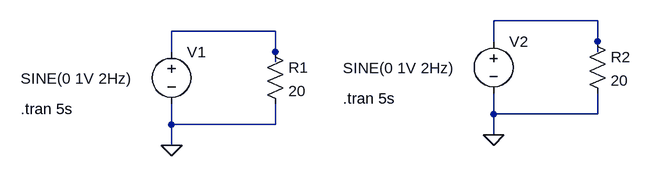
[diagram p0: schematic Cap_Only_V001.asc]
Cap_Only_V001.asc, the LTspice schematic file:
Version 4
SHEET 1 880 680
WIRE 704 128 544 128
WIRE 208 144 48 144
WIRE 544 160 544 128
WIRE 704 160 704 128
WIRE 48 176 48 144
WIRE 208 176 208 144
WIRE 704 176 704 160
WIRE 208 192 208 176
WIRE 544 272 544 240
WIRE 704 272 704 240
WIRE 704 272 544 272
WIRE 48 288 48 256
WIRE 208 288 208 256
WIRE 208 288 48 288
WIRE 544 304 544 272
WIRE 48 320 48 288
FLAG 48 320 0
FLAG 544 304 0
SYMBOL voltage 48 160 R0
WINDOW 3 -232 57 Left 2
WINDOW 123 0 0 Left 0
WINDOW 39 0 0 Left 0
SYMATTR InstName V1
SYMATTR Value SINE(0 1V 2Hz)
SYMBOL res 192 160 R0
SYMATTR InstName R1
SYMATTR Value 20
SYMBOL voltage 544 144 R0
WINDOW 3 -232 57 Left 2
WINDOW 123 0 0 Left 0
WINDOW 39 0 0 Left 0
SYMATTR InstName V2
SYMATTR Value SINE(0 1V 2Hz)
SYMBOL res 688 144 R0
SYMATTR InstName R2
SYMATTR Value 20
TEXT -184 264 Left 2 !.tran 5s
TEXT 312 248 Left 2 !.tran 5s

The netlist it stands for:
* Cap_Only_V001.asc
V1 N002 0 SINE(0 1V 2Hz)
R1 N002 0 20
V2 N001 0 SINE(0 1V 2Hz)
R2 N001 0 20
.tran 5s
.tran 5s
.backanno
.end